# EasyEDA Pro project MN42_v2.eprj, schematic MOAR_Schematic, sheets 1 to 3 of 4

## Sheets
1 PWR/BUTTON/LED: Board Name: MOAR; Create Date: 2025-07-19; Page Name: PWR/BUTTON/LED; Project Name: MN42_v2; Schematic Name: MOAR_Schematic; Update Date: 2025-09-02; Company: EasyEDA.com; Page Size: A4; Version: V1.0
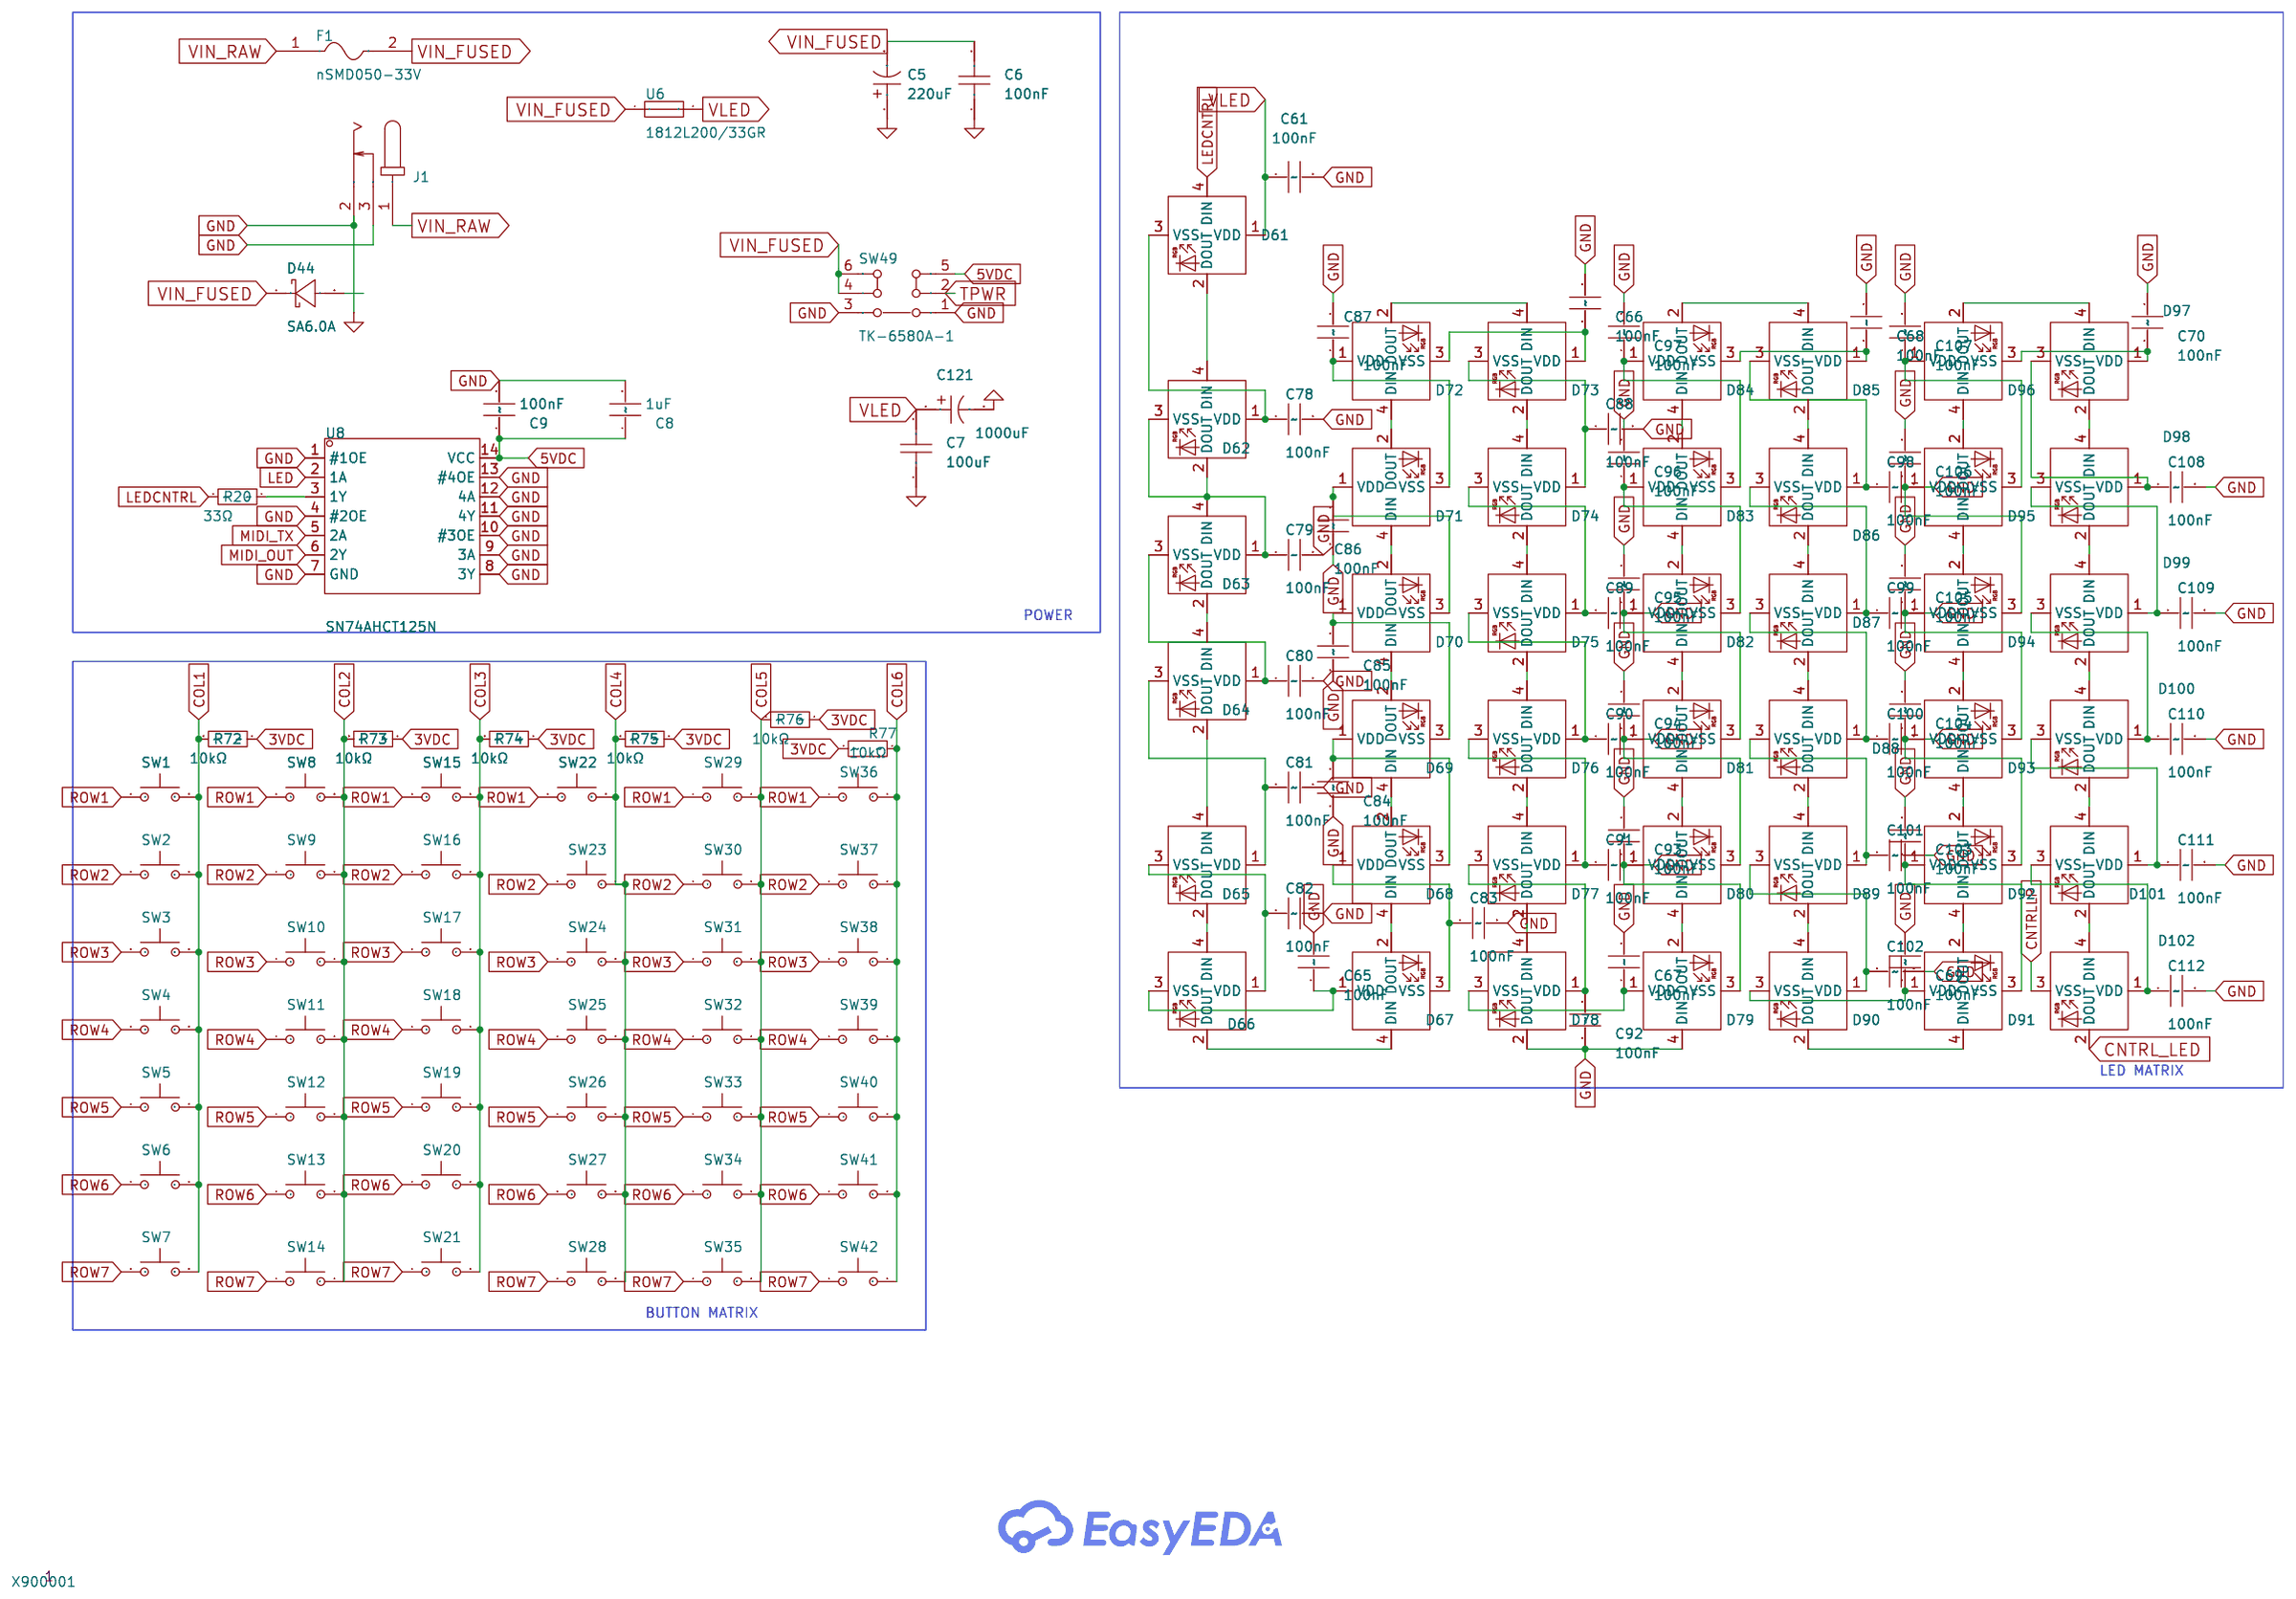
[diagram p0: PWR/BUTTON/LED]
2 INTERFACE/MIDI/CNTRL: Create Date: 2025-08-24; Page Name: INTERFACE/MIDI/CNTRL; Update Date: 2025-08-27
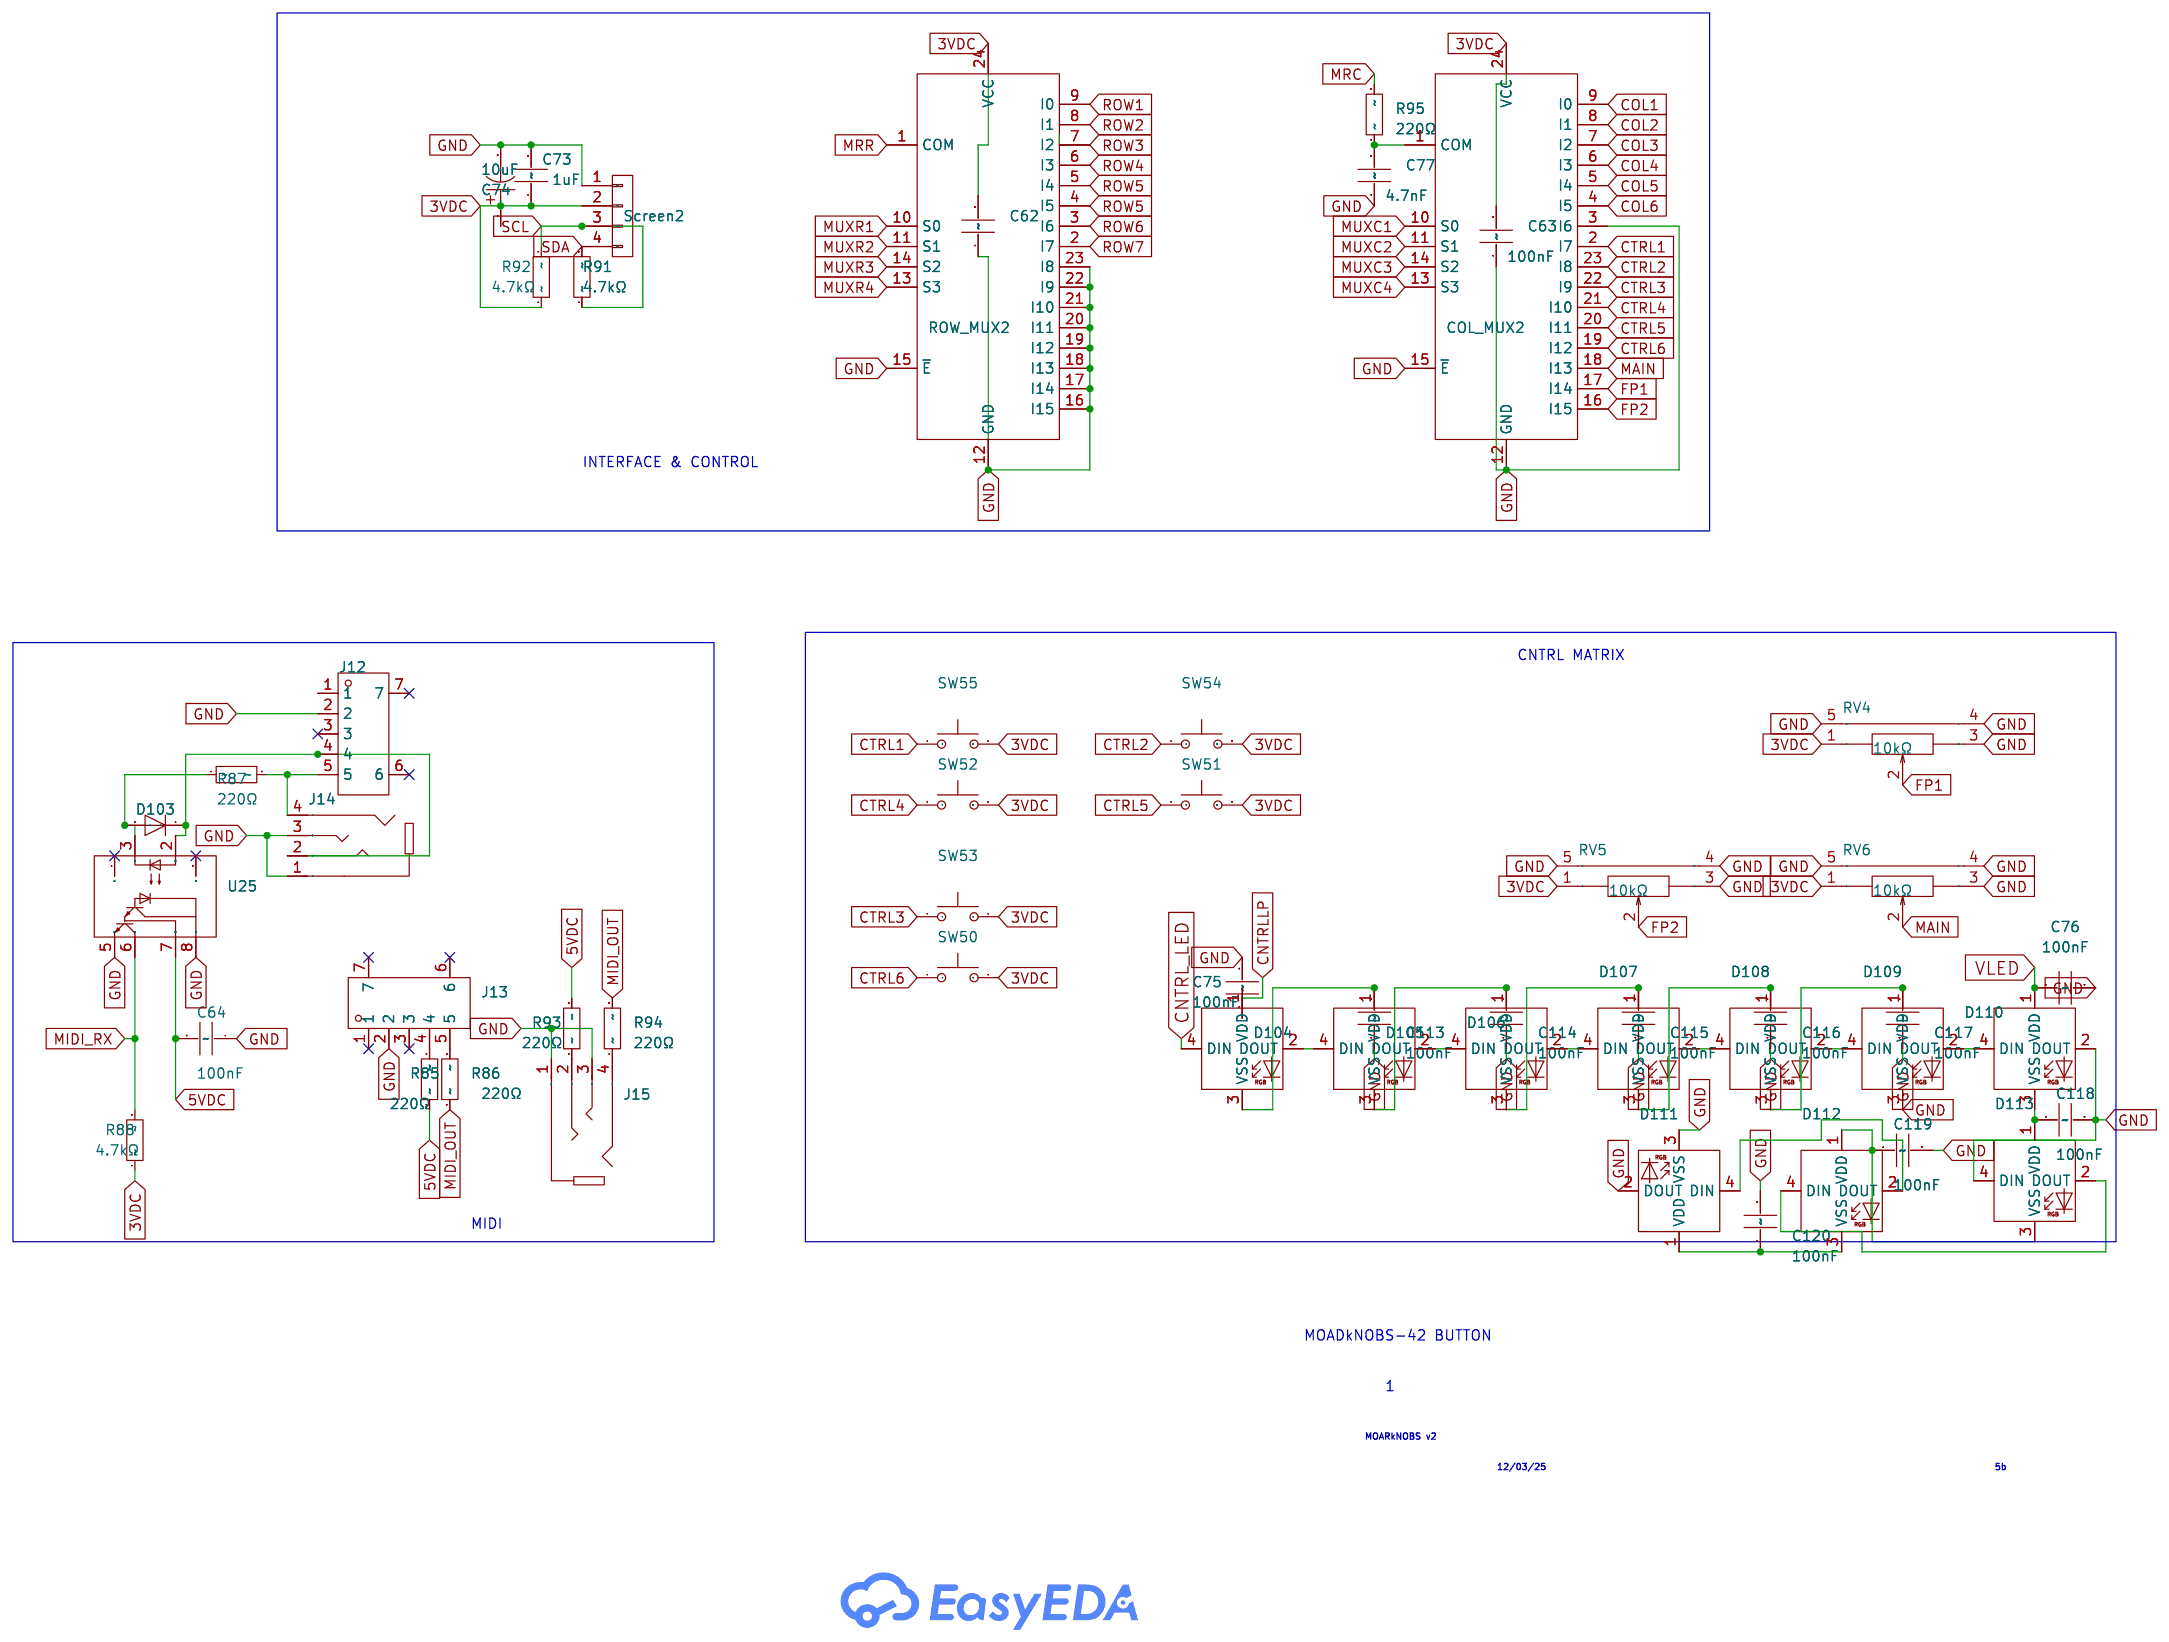
[diagram p1: INTERFACE/MIDI/CNTRL]
3 ENVELOPE: Create Date: 2026-01-12; Page Name: ENVELOPE; Update Date: 2026-01-12
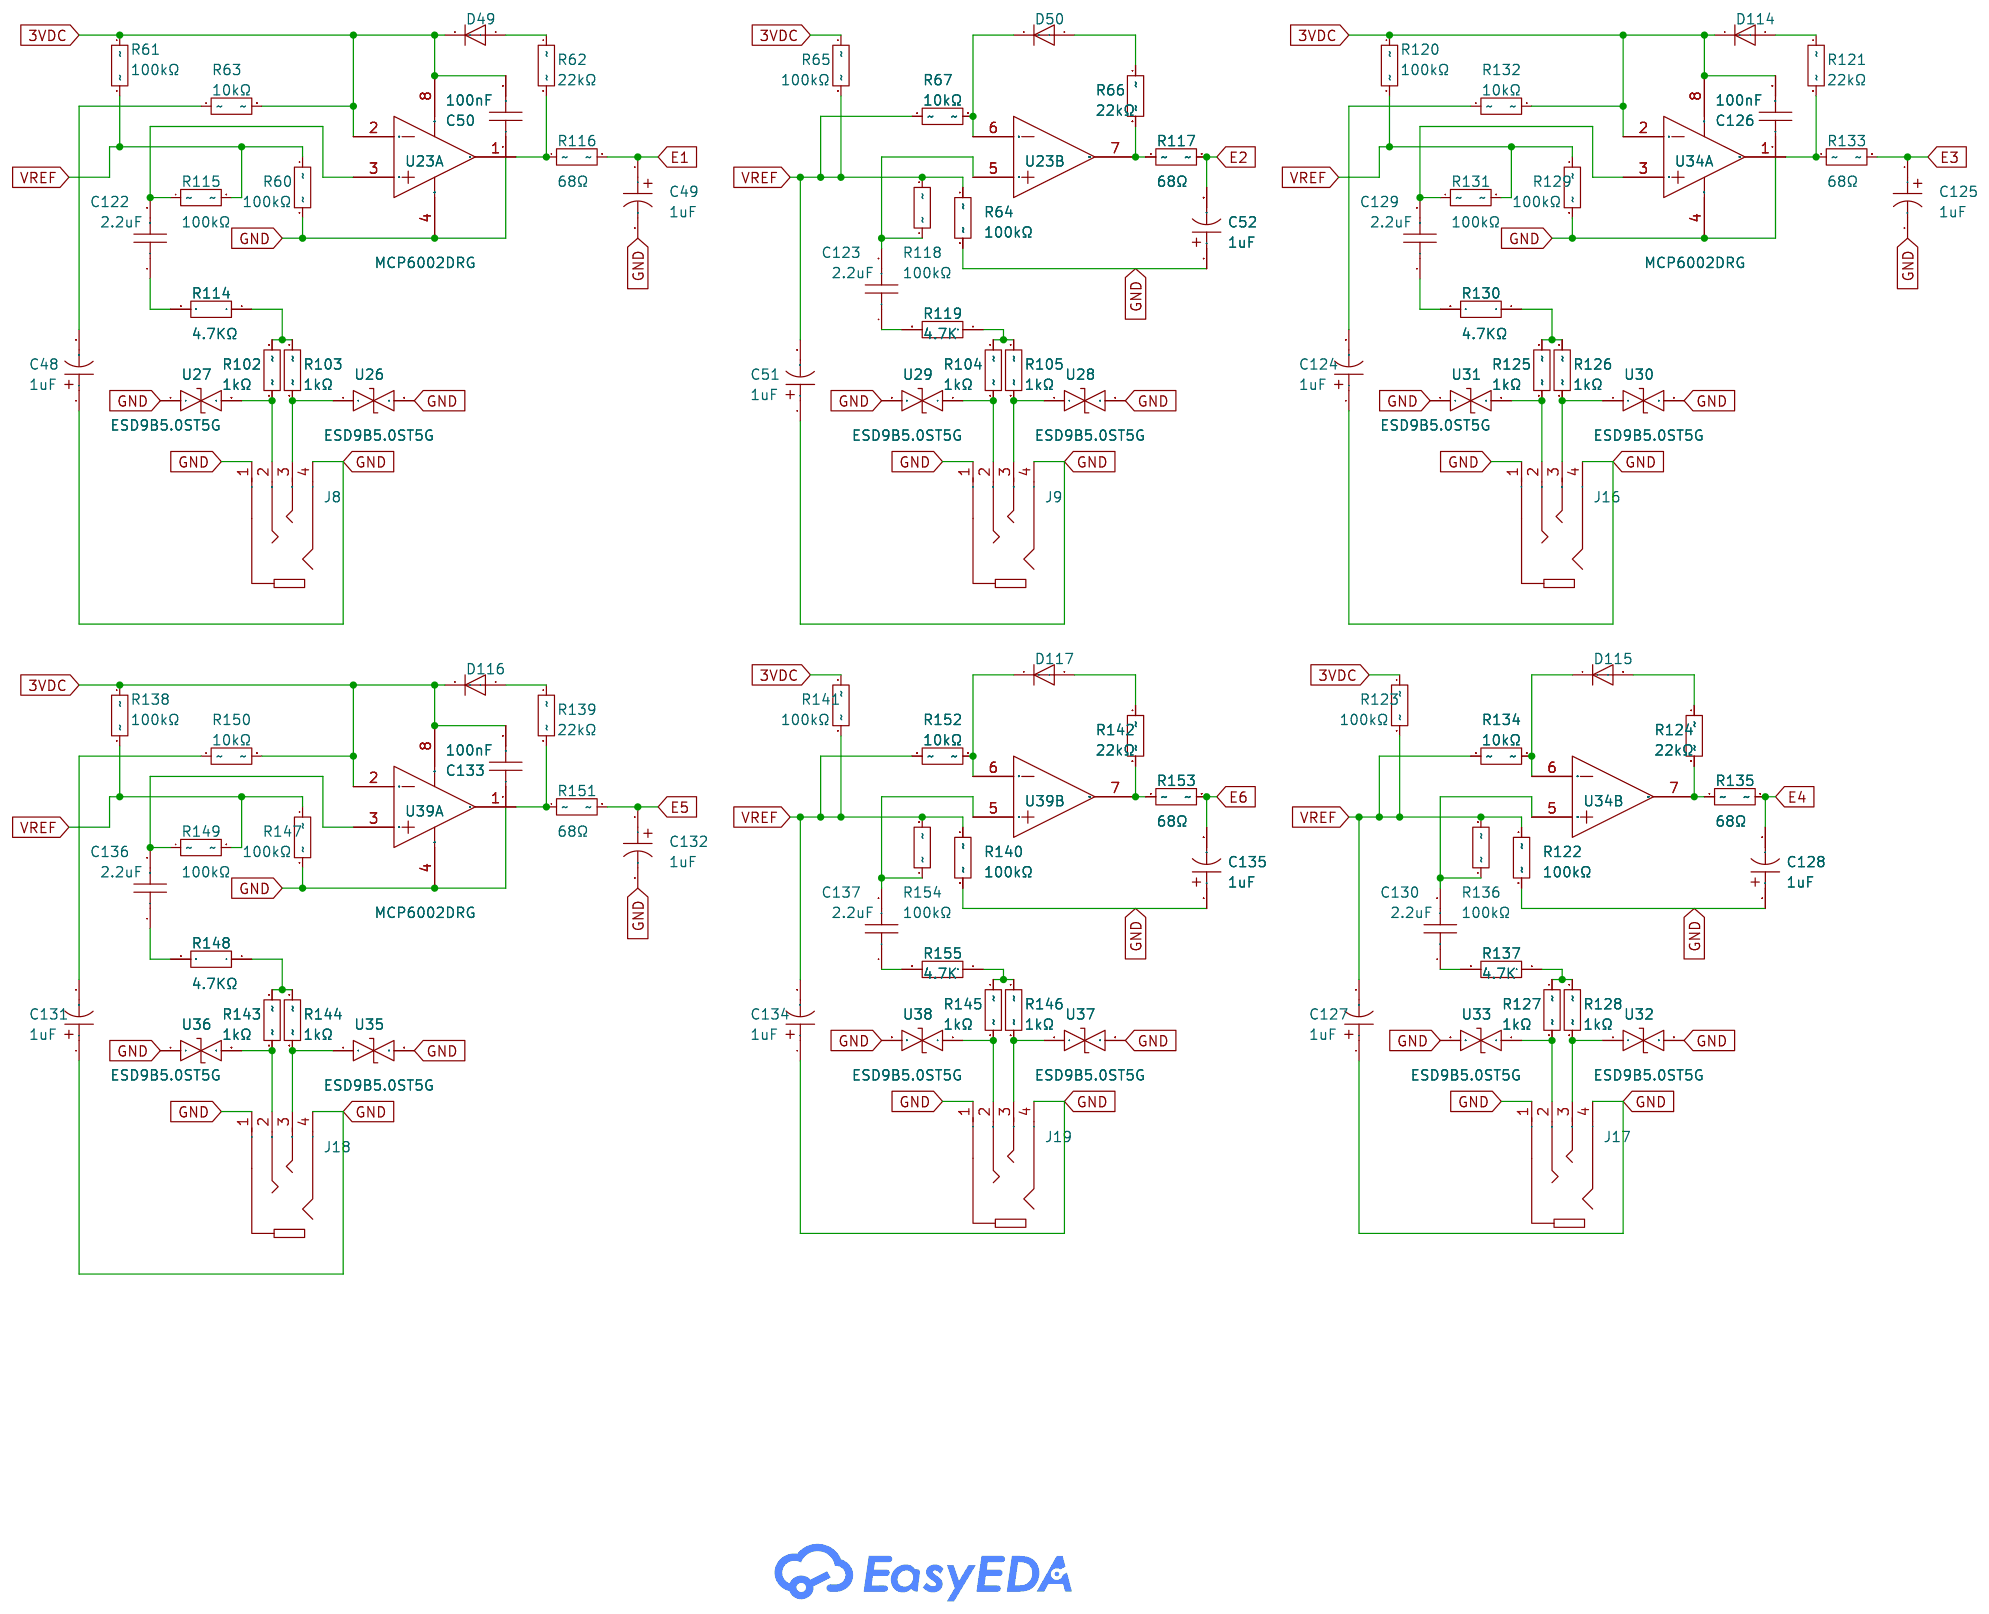
[diagram p2: ENVELOPE]

## Parts
sheet ENVELOPE
C48  1uF  [CAP-SMD_BD6.3-L6.6-W6.6-FD]
C49  1uF  [CAP-SMD_BD6.3-L6.6-W6.6-FD]
C50  100nF  [CAP-TH_L5.0-W2.5-P5.00-D1.0]
C51  1uF  [CAP-SMD_BD6.3-L6.6-W6.6-FD]
C52  1uF  [CAP-SMD_BD6.3-L6.6-W6.6-FD]
C122  2.2uF  [CAP-TH_L5.0-W2.5-P5.00-D1.0]
C123  2.2uF  [CAP-TH_L5.0-W2.5-P5.00-D1.0]
C124  1uF  [CAP-SMD_BD6.3-L6.6-W6.6-FD]
C125  1uF  [CAP-SMD_BD6.3-L6.6-W6.6-FD]
C126  100nF  [CAP-TH_L5.0-W2.5-P5.00-D1.0]
C127  1uF  [CAP-SMD_BD6.3-L6.6-W6.6-FD]
C128  1uF  [CAP-SMD_BD6.3-L6.6-W6.6-FD]
C129  2.2uF  [CAP-TH_L5.0-W2.5-P5.00-D1.0]
C130  2.2uF  [CAP-TH_L5.0-W2.5-P5.00-D1.0]
C131  1uF  [CAP-SMD_BD6.3-L6.6-W6.6-FD]
C132  1uF  [CAP-SMD_BD6.3-L6.6-W6.6-FD]
C133  100nF  [CAP-TH_L5.0-W2.5-P5.00-D1.0]
C134  1uF  [CAP-SMD_BD6.3-L6.6-W6.6-FD]
C135  1uF  [CAP-SMD_BD6.3-L6.6-W6.6-FD]
C136  2.2uF  [CAP-TH_L5.0-W2.5-P5.00-D1.0]
C137  2.2uF  [CAP-TH_L5.0-W2.5-P5.00-D1.0]
D49  1N4148PF  [DO-35_BD1.9-L3.9-P7.90-D0.5-FD]
D50  1N4148PF  [DO-35_BD1.9-L3.9-P7.90-D0.5-FD]
D114  1N4148PF  [DO-35_BD1.9-L3.9-P7.90-D0.5-FD]
D115  1N4148PF  [DO-35_BD1.9-L3.9-P7.90-D0.5-FD]
D116  1N4148PF  [DO-35_BD1.9-L3.9-P7.90-D0.5-FD]
D117  1N4148PF  [DO-35_BD1.9-L3.9-P7.90-D0.5-FD]
J8  HC-PJ-320A  [AUDIO-SMD_HC-PJ-320A]
J9  HC-PJ-320A  [AUDIO-SMD_HC-PJ-320A]
J16  HC-PJ-320A  [AUDIO-SMD_HC-PJ-320A]
J17  HC-PJ-320A  [AUDIO-SMD_HC-PJ-320A]
J18  HC-PJ-320A  [AUDIO-SMD_HC-PJ-320A]
J19  HC-PJ-320A  [AUDIO-SMD_HC-PJ-320A]
R60  100kΩ  [RES-TH_BD1.7-L3.5-P7.50-D0.5]
R61  100kΩ  [RES-TH_BD1.7-L3.5-P7.50-D0.5]
R62  22kΩ  [RES-TH_BD1.7-L3.5-P7.50-D0.5]
R63  10kΩ  [RES-TH_BD1.7-L3.5-P7.50-D0.5]
R64  100kΩ  [RES-TH_BD1.7-L3.5-P7.50-D0.5]
R65  100kΩ  [RES-TH_BD1.7-L3.5-P7.50-D0.5]
R66  22kΩ  [RES-TH_BD1.7-L3.5-P7.50-D0.5]
R67  10kΩ  [RES-TH_BD1.7-L3.5-P7.50-D0.5]
R102  1kΩ  [RES-TH_BD1.7-L3.5-P7.50-D0.5]
R103  1kΩ  [RES-TH_BD1.7-L3.5-P7.50-D0.5]
R104  1kΩ  [RES-TH_BD1.7-L3.5-P7.50-D0.5]
R105  1kΩ  [RES-TH_BD1.7-L3.5-P7.50-D0.5]
R114  4.7KΩ  [R0603]
R115  100kΩ  [RES-TH_BD1.7-L3.5-P7.50-D0.5]
R116  68Ω  [RES-TH_BD1.7-L3.5-P7.50-D0.5]
R117  68Ω  [RES-TH_BD1.7-L3.5-P7.50-D0.5]
R118  100kΩ  [RES-TH_BD1.7-L3.5-P7.50-D0.5]
R119  4.7K  [R0603]
R120  100kΩ  [RES-TH_BD1.7-L3.5-P7.50-D0.5]
R121  22kΩ  [RES-TH_BD1.7-L3.5-P7.50-D0.5]
R122  100kΩ  [RES-TH_BD1.7-L3.5-P7.50-D0.5]
R123  100kΩ  [RES-TH_BD1.7-L3.5-P7.50-D0.5]
R124  22kΩ  [RES-TH_BD1.7-L3.5-P7.50-D0.5]
R125  1kΩ  [RES-TH_BD1.7-L3.5-P7.50-D0.5]
R126  1kΩ  [RES-TH_BD1.7-L3.5-P7.50-D0.5]
R127  1kΩ  [RES-TH_BD1.7-L3.5-P7.50-D0.5]
R128  1kΩ  [RES-TH_BD1.7-L3.5-P7.50-D0.5]
R129  100kΩ  [RES-TH_BD1.7-L3.5-P7.50-D0.5]
R130  4.7KΩ  [R0603]
R131  100kΩ  [RES-TH_BD1.7-L3.5-P7.50-D0.5]
R132  10kΩ  [RES-TH_BD1.7-L3.5-P7.50-D0.5]
R133  68Ω  [RES-TH_BD1.7-L3.5-P7.50-D0.5]
R134  10kΩ  [RES-TH_BD1.7-L3.5-P7.50-D0.5]
R135  68Ω  [RES-TH_BD1.7-L3.5-P7.50-D0.5]
R136  100kΩ  [RES-TH_BD1.7-L3.5-P7.50-D0.5]
R137  4.7K  [R0603]
R138  100kΩ  [RES-TH_BD1.7-L3.5-P7.50-D0.5]
R139  22kΩ  [RES-TH_BD1.7-L3.5-P7.50-D0.5]
R140  100kΩ  [RES-TH_BD1.7-L3.5-P7.50-D0.5]
R141  100kΩ  [RES-TH_BD1.7-L3.5-P7.50-D0.5]
R142  22kΩ  [RES-TH_BD1.7-L3.5-P7.50-D0.5]
R143  1kΩ  [RES-TH_BD1.7-L3.5-P7.50-D0.5]
R144  1kΩ  [RES-TH_BD1.7-L3.5-P7.50-D0.5]
R145  1kΩ  [RES-TH_BD1.7-L3.5-P7.50-D0.5]
R146  1kΩ  [RES-TH_BD1.7-L3.5-P7.50-D0.5]
R147  100kΩ  [RES-TH_BD1.7-L3.5-P7.50-D0.5]
R148  4.7KΩ  [R0603]
R149  100kΩ  [RES-TH_BD1.7-L3.5-P7.50-D0.5]
R150  10kΩ  [RES-TH_BD1.7-L3.5-P7.50-D0.5]
R151  68Ω  [RES-TH_BD1.7-L3.5-P7.50-D0.5]
R152  10kΩ  [RES-TH_BD1.7-L3.5-P7.50-D0.5]
R153  68Ω  [RES-TH_BD1.7-L3.5-P7.50-D0.5]
R154  100kΩ  [RES-TH_BD1.7-L3.5-P7.50-D0.5]
R155  4.7K  [R0603]
U23  MCP6002DRG  [SOP-8_L4.9-W3.9-P1.27-LS6.0-BL]  (sections 1,2)
U26  ESD9B5.0ST5G  [SOD-923_L0.8-W0.6-LS1.0-BI]
U27  ESD9B5.0ST5G  [SOD-923_L0.8-W0.6-LS1.0-BI]
U28  ESD9B5.0ST5G  [SOD-923_L0.8-W0.6-LS1.0-BI]
U29  ESD9B5.0ST5G  [SOD-923_L0.8-W0.6-LS1.0-BI]
U30  ESD9B5.0ST5G  [SOD-923_L0.8-W0.6-LS1.0-BI]
U31  ESD9B5.0ST5G  [SOD-923_L0.8-W0.6-LS1.0-BI]
U32  ESD9B5.0ST5G  [SOD-923_L0.8-W0.6-LS1.0-BI]
U33  ESD9B5.0ST5G  [SOD-923_L0.8-W0.6-LS1.0-BI]
U34  MCP6002DRG  [SOP-8_L4.9-W3.9-P1.27-LS6.0-BL]  (sections 1,2)
U35  ESD9B5.0ST5G  [SOD-923_L0.8-W0.6-LS1.0-BI]
U36  ESD9B5.0ST5G  [SOD-923_L0.8-W0.6-LS1.0-BI]
U37  ESD9B5.0ST5G  [SOD-923_L0.8-W0.6-LS1.0-BI]
U38  ESD9B5.0ST5G  [SOD-923_L0.8-W0.6-LS1.0-BI]
U39  MCP6002DRG  [SOP-8_L4.9-W3.9-P1.27-LS6.0-BL]  (sections 1,2)
sheet INTERFACE/MIDI/CNTRL
C62  100nF  [C0603]
C63  100nF  [C0603]
C64  100nF  [C0603]
C73  1uF  [CAP-TH_L5.0-W4.0-P5.00-D1.0]
C74  10uF  [CAP-SMD_BD6.3-L6.6-W6.6-FD]
C75  100nF  [C0603]
C76  100nF  [C0603]
C77  4.7nF  [CAP-TH_L5.0-W4.0-P5.00-D1.0]
C113  100nF  [C0603]
C114  100nF  [C0603]
C115  100nF  [C0603]
C116  100nF  [C0603]
C117  100nF  [C0603]
C118  100nF  [C0603]
C119  100nF  [C0603]
C120  100nF  [C0603]
COL_MUX2  CD74HC4067M96  [SOIC-24_L15.4-W7.5-P1.27-LS10.3-BL]
D103  1N4148PF  [DO-35_BD1.9-L3.9-P7.90-D0.5-FD]
D104  XL-5050RGBC-WS2812B  [LED-SMD_4P-L5.0-W5.0-BL_XL-5050RGBC]
D105  XL-5050RGBC-WS2812B  [LED-SMD_4P-L5.0-W5.0-BL_XL-5050RGBC]
D106  XL-5050RGBC-WS2812B  [LED-SMD_4P-L5.0-W5.0-BL_XL-5050RGBC]
D107  XL-5050RGBC-WS2812B  [LED-SMD_4P-L5.0-W5.0-BL_XL-5050RGBC]
D108  XL-5050RGBC-WS2812B  [LED-SMD_4P-L5.0-W5.0-BL_XL-5050RGBC]
D109  XL-5050RGBC-WS2812B  [LED-SMD_4P-L5.0-W5.0-BL_XL-5050RGBC]
D110  XL-5050RGBC-WS2812B  [LED-SMD_4P-L5.0-W5.0-BL_XL-5050RGBC]
D111  XL-5050RGBC-WS2812B  [LED-SMD_4P-L5.0-W5.0-BL_XL-5050RGBC]
D112  XL-5050RGBC-WS2812B  [LED-SMD_4P-L5.0-W5.0-BL_XL-5050RGBC]
D113  XL-5050RGBC-WS2812B  [LED-SMD_4P-L5.0-W5.0-BL_XL-5050RGBC]
J12  DIN-504B-M10  [CONN-TH_DIN-504B-M10]
J13  DIN-504B-M10  [CONN-TH_DIN-504B-M10]
J14  HC-PJ-320A  [AUDIO-SMD_HC-PJ-320A]
J15  HC-PJ-320A  [AUDIO-SMD_HC-PJ-320A]
R85  220Ω  [RES-TH_BD1.7-L3.5-P7.50-D0.5]
R86  220Ω  [RES-TH_BD1.7-L3.5-P7.50-D0.5]
R87  220Ω  [RES-TH_BD1.7-L3.5-P7.50-D0.5]
R88  4.7kΩ  [RES-TH_BD1.7-L3.5-P7.50-D0.5]
R91  4.7kΩ  [RES-TH_BD1.7-L3.5-P7.50-D0.5]
R92  4.7kΩ  [RES-TH_BD1.7-L3.5-P7.50-D0.5]
R93  220Ω  [RES-TH_BD1.7-L3.5-P7.50-D0.5]
R94  220Ω  [RES-TH_BD1.7-L3.5-P7.50-D0.5]
R95  220Ω  [RES-TH_BD1.7-L3.5-P7.50-D0.5]
ROW_MUX2  CD74HC4067M96  [SOIC-24_L15.4-W7.5-P1.27-LS10.3-BL]
RV4  10kΩ  [RES-ADJ-TH_RK09K1130A5R]
RV5  10kΩ  [RES-ADJ-TH_RK09K1130A5R]
RV6  10kΩ  [RES-ADJ-TH_RK09K1130A5R]
Screen2  HS96L03W2C03  [OLED-TH_L27.8-W27.2-P2.54_C9900033791]
SW50  HX B3F-4055-Y  [SW-TH_4P-L12.0-W12.0-P5.00-LS12.5]
SW51  HX B3F-4055-Y  [SW-TH_4P-L12.0-W12.0-P5.00-LS12.5]
SW52  HX B3F-4055-Y  [SW-TH_4P-L12.0-W12.0-P5.00-LS12.5]
SW53  HX B3F-4055-Y  [SW-TH_4P-L12.0-W12.0-P5.00-LS12.5]
SW54  HX B3F-4055-Y  [SW-TH_4P-L12.0-W12.0-P5.00-LS12.5]
SW55  HX B3F-4055-Y  [SW-TH_4P-L12.0-W12.0-P5.00-LS12.5]
U25  6N138  [DIP-8_L9.8-W6.6-P2.54-LS7.6-BL]
sheet PWR/BUTTON/LED
C5  220uF  [CAP-SMD_BD6.3-L6.6-W6.6-FD]
C6  100nF  [CAP-TH_L5.0-W2.5-P5.00-D1.0]
C7  100uF  [C1206]
C8  1uF  [CAP-TH_L5.0-W4.0-P5.00-D1.0]
C9  100nF  [C0603]
C61  100nF  [C0603]
C65  100nF  [C0603]
C66  100nF  [C0603]
C67  100nF  [C0603]
C68  100nF  [C0603]
C69  100nF  [C0603]
C70  100nF  [C0603]
C78  100nF  [C0603]
C79  100nF  [C0603]
C80  100nF  [C0603]
C81  100nF  [C0603]
C82  100nF  [C0603]
C83  100nF  [C0603]
C84  100nF  [C0603]
C85  100nF  [C0603]
C86  100nF  [C0603]
C87  100nF  [C0603]
C88  100nF  [C0603]
C89  100nF  [C0603]
C90  100nF  [C0603]
C91  100nF  [C0603]
C92  100nF  [C0603]
C93  100nF  [C0603]
C94  100nF  [C0603]
C95  100nF  [C0603]
C96  100nF  [C0603]
C97  100nF  [C0603]
C98  100nF  [C0603]
C99  100nF  [C0603]
C100  100nF  [C0603]
C101  100nF  [C0603]
C102  100nF  [C0603]
C103  100nF  [C0603]
C104  100nF  [C0603]
C105  100nF  [C0603]
C106  100nF  [C0603]
C107  100nF  [C0603]
C108  100nF  [C0603]
C109  100nF  [C0603]
C110  100nF  [C0603]
C111  100nF  [C0603]
C112  100nF  [C0603]
C121  1000uF  [CAP-TH_BD8.0-P3.50-D0.6-FD]
D44  SA6.0A  [DO-15_BD3.1-L6.7-P10.70-D0.8-RD]
D61  XL-5050RGBC-WS2812B  [LED-SMD_4P-L5.0-W5.0-BL_XL-5050RGBC]
D62  XL-5050RGBC-WS2812B  [LED-SMD_4P-L5.0-W5.0-BL_XL-5050RGBC]
D63  XL-5050RGBC-WS2812B  [LED-SMD_4P-L5.0-W5.0-BL_XL-5050RGBC]
D64  XL-5050RGBC-WS2812B  [LED-SMD_4P-L5.0-W5.0-BL_XL-5050RGBC]
D65  XL-5050RGBC-WS2812B  [LED-SMD_4P-L5.0-W5.0-BL_XL-5050RGBC]
D66  XL-5050RGBC-WS2812B  [LED-SMD_4P-L5.0-W5.0-BL_XL-5050RGBC]
D67  XL-5050RGBC-WS2812B  [LED-SMD_4P-L5.0-W5.0-BL_XL-5050RGBC]
D68  XL-5050RGBC-WS2812B  [LED-SMD_4P-L5.0-W5.0-BL_XL-5050RGBC]
D69  XL-5050RGBC-WS2812B  [LED-SMD_4P-L5.0-W5.0-BL_XL-5050RGBC]
D70  XL-5050RGBC-WS2812B  [LED-SMD_4P-L5.0-W5.0-BL_XL-5050RGBC]
D71  XL-5050RGBC-WS2812B  [LED-SMD_4P-L5.0-W5.0-BL_XL-5050RGBC]
D72  XL-5050RGBC-WS2812B  [LED-SMD_4P-L5.0-W5.0-BL_XL-5050RGBC]
D73  XL-5050RGBC-WS2812B  [LED-SMD_4P-L5.0-W5.0-BL_XL-5050RGBC]
D74  XL-5050RGBC-WS2812B  [LED-SMD_4P-L5.0-W5.0-BL_XL-5050RGBC]
D75  XL-5050RGBC-WS2812B  [LED-SMD_4P-L5.0-W5.0-BL_XL-5050RGBC]
D76  XL-5050RGBC-WS2812B  [LED-SMD_4P-L5.0-W5.0-BL_XL-5050RGBC]
D77  XL-5050RGBC-WS2812B  [LED-SMD_4P-L5.0-W5.0-BL_XL-5050RGBC]
D78  XL-5050RGBC-WS2812B  [LED-SMD_4P-L5.0-W5.0-BL_XL-5050RGBC]
D79  XL-5050RGBC-WS2812B  [LED-SMD_4P-L5.0-W5.0-BL_XL-5050RGBC]
D80  XL-5050RGBC-WS2812B  [LED-SMD_4P-L5.0-W5.0-BL_XL-5050RGBC]
D81  XL-5050RGBC-WS2812B  [LED-SMD_4P-L5.0-W5.0-BL_XL-5050RGBC]
D82  XL-5050RGBC-WS2812B  [LED-SMD_4P-L5.0-W5.0-BL_XL-5050RGBC]
D83  XL-5050RGBC-WS2812B  [LED-SMD_4P-L5.0-W5.0-BL_XL-5050RGBC]
D84  XL-5050RGBC-WS2812B  [LED-SMD_4P-L5.0-W5.0-BL_XL-5050RGBC]
D85  XL-5050RGBC-WS2812B  [LED-SMD_4P-L5.0-W5.0-BL_XL-5050RGBC]
D86  XL-5050RGBC-WS2812B  [LED-SMD_4P-L5.0-W5.0-BL_XL-5050RGBC]
D87  XL-5050RGBC-WS2812B  [LED-SMD_4P-L5.0-W5.0-BL_XL-5050RGBC]
D88  XL-5050RGBC-WS2812B  [LED-SMD_4P-L5.0-W5.0-BL_XL-5050RGBC]
D89  XL-5050RGBC-WS2812B  [LED-SMD_4P-L5.0-W5.0-BL_XL-5050RGBC]
D90  XL-5050RGBC-WS2812B  [LED-SMD_4P-L5.0-W5.0-BL_XL-5050RGBC]
D91  XL-5050RGBC-WS2812B  [LED-SMD_4P-L5.0-W5.0-BL_XL-5050RGBC]
D92  XL-5050RGBC-WS2812B  [LED-SMD_4P-L5.0-W5.0-BL_XL-5050RGBC]
D93  XL-5050RGBC-WS2812B  [LED-SMD_4P-L5.0-W5.0-BL_XL-5050RGBC]
D94  XL-5050RGBC-WS2812B  [LED-SMD_4P-L5.0-W5.0-BL_XL-5050RGBC]
D95  XL-5050RGBC-WS2812B  [LED-SMD_4P-L5.0-W5.0-BL_XL-5050RGBC]
D96  XL-5050RGBC-WS2812B  [LED-SMD_4P-L5.0-W5.0-BL_XL-5050RGBC]
D97  XL-5050RGBC-WS2812B  [LED-SMD_4P-L5.0-W5.0-BL_XL-5050RGBC]
D98  XL-5050RGBC-WS2812B  [LED-SMD_4P-L5.0-W5.0-BL_XL-5050RGBC]
D99  XL-5050RGBC-WS2812B  [LED-SMD_4P-L5.0-W5.0-BL_XL-5050RGBC]
D100  XL-5050RGBC-WS2812B  [LED-SMD_4P-L5.0-W5.0-BL_XL-5050RGBC]
D101  XL-5050RGBC-WS2812B  [LED-SMD_4P-L5.0-W5.0-BL_XL-5050RGBC]
D102  XL-5050RGBC-WS2812B  [LED-SMD_4P-L5.0-W5.0-BL_XL-5050RGBC]
F1  nSMD050-33V  [F1206]
J1  DC005  [DC-IN-TH_DC005]
R20  33Ω  [RES-TH_BD1.7-L3.5-P7.50-D0.5]
R72  10kΩ  [RES-TH_BD1.7-L3.5-P7.50-D0.5]
R73  10kΩ  [RES-TH_BD1.7-L3.5-P7.50-D0.5]
R74  10kΩ  [RES-TH_BD1.7-L3.5-P7.50-D0.5]
R75  10kΩ  [RES-TH_BD1.7-L3.5-P7.50-D0.5]
R76  10kΩ  [RES-TH_BD1.7-L3.5-P7.50-D0.5]
R77  10kΩ  [RES-TH_BD1.7-L3.5-P7.50-D0.5]
SW1  HX B3F-4055-Y  [SW-TH_4P-L12.0-W12.0-P5.00-LS12.5]
SW2  HX B3F-4055-Y  [SW-TH_4P-L12.0-W12.0-P5.00-LS12.5]
SW3  HX B3F-4055-Y  [SW-TH_4P-L12.0-W12.0-P5.00-LS12.5]
SW4  HX B3F-4055-Y  [SW-TH_4P-L12.0-W12.0-P5.00-LS12.5]
SW5  HX B3F-4055-Y  [SW-TH_4P-L12.0-W12.0-P5.00-LS12.5]
SW6  HX B3F-4055-Y  [SW-TH_4P-L12.0-W12.0-P5.00-LS12.5]
SW7  HX B3F-4055-Y  [SW-TH_4P-L12.0-W12.0-P5.00-LS12.5]
SW8  HX B3F-4055-Y  [SW-TH_4P-L12.0-W12.0-P5.00-LS12.5]
SW9  HX B3F-4055-Y  [SW-TH_4P-L12.0-W12.0-P5.00-LS12.5]
SW10  HX B3F-4055-Y  [SW-TH_4P-L12.0-W12.0-P5.00-LS12.5]
SW11  HX B3F-4055-Y  [SW-TH_4P-L12.0-W12.0-P5.00-LS12.5]
SW12  HX B3F-4055-Y  [SW-TH_4P-L12.0-W12.0-P5.00-LS12.5]
SW13  HX B3F-4055-Y  [SW-TH_4P-L12.0-W12.0-P5.00-LS12.5]
SW14  HX B3F-4055-Y  [SW-TH_4P-L12.0-W12.0-P5.00-LS12.5]
SW15  HX B3F-4055-Y  [SW-TH_4P-L12.0-W12.0-P5.00-LS12.5]
SW16  HX B3F-4055-Y  [SW-TH_4P-L12.0-W12.0-P5.00-LS12.5]
SW17  HX B3F-4055-Y  [SW-TH_4P-L12.0-W12.0-P5.00-LS12.5]
SW18  HX B3F-4055-Y  [SW-TH_4P-L12.0-W12.0-P5.00-LS12.5]
SW19  HX B3F-4055-Y  [SW-TH_4P-L12.0-W12.0-P5.00-LS12.5]
SW20  HX B3F-4055-Y  [SW-TH_4P-L12.0-W12.0-P5.00-LS12.5]
SW21  HX B3F-4055-Y  [SW-TH_4P-L12.0-W12.0-P5.00-LS12.5]
SW22  HX B3F-4055-Y  [SW-TH_4P-L12.0-W12.0-P5.00-LS12.5]
SW23  HX B3F-4055-Y  [SW-TH_4P-L12.0-W12.0-P5.00-LS12.5]
SW24  HX B3F-4055-Y  [SW-TH_4P-L12.0-W12.0-P5.00-LS12.5]
SW25  HX B3F-4055-Y  [SW-TH_4P-L12.0-W12.0-P5.00-LS12.5]
SW26  HX B3F-4055-Y  [SW-TH_4P-L12.0-W12.0-P5.00-LS12.5]
SW27  HX B3F-4055-Y  [SW-TH_4P-L12.0-W12.0-P5.00-LS12.5]
SW28  HX B3F-4055-Y  [SW-TH_4P-L12.0-W12.0-P5.00-LS12.5]
SW29  HX B3F-4055-Y  [SW-TH_4P-L12.0-W12.0-P5.00-LS12.5]
SW30  HX B3F-4055-Y  [SW-TH_4P-L12.0-W12.0-P5.00-LS12.5]
SW31  HX B3F-4055-Y  [SW-TH_4P-L12.0-W12.0-P5.00-LS12.5]
SW32  HX B3F-4055-Y  [SW-TH_4P-L12.0-W12.0-P5.00-LS12.5]
SW33  HX B3F-4055-Y  [SW-TH_4P-L12.0-W12.0-P5.00-LS12.5]
SW34  HX B3F-4055-Y  [SW-TH_4P-L12.0-W12.0-P5.00-LS12.5]
SW35  HX B3F-4055-Y  [SW-TH_4P-L12.0-W12.0-P5.00-LS12.5]
SW36  HX B3F-4055-Y  [SW-TH_4P-L12.0-W12.0-P5.00-LS12.5]
SW37  HX B3F-4055-Y  [SW-TH_4P-L12.0-W12.0-P5.00-LS12.5]
SW38  HX B3F-4055-Y  [SW-TH_4P-L12.0-W12.0-P5.00-LS12.5]
SW39  HX B3F-4055-Y  [SW-TH_4P-L12.0-W12.0-P5.00-LS12.5]
SW40  HX B3F-4055-Y  [SW-TH_4P-L12.0-W12.0-P5.00-LS12.5]
SW41  HX B3F-4055-Y  [SW-TH_4P-L12.0-W12.0-P5.00-LS12.5]
SW42  HX B3F-4055-Y  [SW-TH_4P-L12.0-W12.0-P5.00-LS12.5]
SW49  TK-6580A-1  [SW-TH_TK-6580A-1]
U6  1812L200/33GR  [F1812]
U8  SN74AHCT125N  [PDIP-14_L19.3-W6.4-P2.54-LS7.6-BL]

## Library data of the parts
C5 C48 C49 C51 C52 C74 C124 C125 C127 C128 C131 C132 C134 C135 = 189RV0019: Capacitance:220uF Tolerance:±20% Tolerance:±20% Voltage Rating:35V Ripple Current:600mA@100KHz Equivalent Series Resistance(ESR):160mΩ@100KHz Diameter:6.3mm Height - Seated (Max):7.7mm Lifetime:2000hrs@105℃ Operating Temperature:-55℃~+105℃ Operating Tempe; LCSC Part Name: 220uF ±20% 35V; Supplier Part: C7471881; Manufacturer: KNSCHA(科尼盛); Supplier Footprint: SMD,D6.3xL7.7mm; JLCPCB Part Class: Extended Part; Datasheet: https://atta.szlcsc.com/upload/public/pdf/source/20230907/E1EFA38CB5E88857ECE494F7E9D8FBCC.pdf; Supplier: LCSC; Tolerance: ±20%; Voltage Rating: 35V; Ripple Current: 600mA@100KHz; Equivalent Series Resistance(ESR): 160mΩ@100KHz; Diameter: 6.3mm; Height - Seated (Max): 7.7mm; Lifetime: 2000hrs@105℃; Operating Temperature: -55℃~+105℃
C6 C50 C122 C123 C126 C129 C130 C133 C136 C137 = CC1H104MC1FD3F6C10MF: Capacitance:100nF Tolerance:±20% Tolerance:±20% Voltage Rating:50V Pin Spacing:5.08mm Temperature Coefficient:Y5V Diameter:6mm Body Thickness:2.2mm; LCSC Part Name: 100nF ±20% 50V; Supplier Part: C254085; Manufacturer: Dersonic(德尔创); Supplier Footprint: 插件,P=5.08mm; JLCPCB Part Class: Extended Part; Datasheet: https://atta.szlcsc.com/upload/public/pdf/source/20200826/C254085_159DD65BF32BF11C9168D341BCE23E6F.pdf; Supplier: LCSC; Tolerance: ±20%; Voltage Rating: 50V; Pin Spacing: 5.08mm; Temperature Coefficient: Y5V; Diameter: 6mm; Body Thickness: 2.2mm
D49 D50 D103 D114-D117 = 1N4148PF: Supplier Part: C2992430; Manufacturer: ST(先科); Supplier Footprint: DO-35; JLCPCB Part Class: Extended Part; Datasheet: https://atta.szlcsc.com/upload/public/pdf/source/20220414/133B43E450E13E2641A7D12D66654211.pdf; Supplier: LCSC
J8 J9 J14-J19 = HC-PJ-320A: Connector Type:3.5mm Headphone Jack Current Rating:500mA Voltage Rating (Max):30V Contact Material:Copper Contact Plating:Nickel Operating Temperature:-25℃~+70℃ Operating Temperature:-25℃~+70℃; LCSC Part Name: 黑色 3.5mm耳机座 PJ-320A 插件黑色; Supplier Part: C7501806; Manufacturer: HC(虹成电子); Supplier Footprint: 插件; JLCPCB Part Class: Extended Part; Datasheet: https://atta.szlcsc.com/upload/public/pdf/source/20250106/7D33987A36C8C755DD3F52F3C7FA5722.pdf; Supplier: LCSC; Connector Type: 3.5mm Headphone Jack; Current Rating: 500mA; Voltage Rating (Max): 30V; Contact Material: Copper; Contact Plating: Nickel; Operating Temperature: -25℃~+70℃
R60-R67 R88 R91 R92 R102-R105 R115-R118 R120-R129 R131-R136 R138-R147 R149-R154 = RN 1/8W 4K7 F T/B A1: Type:Metal Film Resistors Resistance: Tolerance:±1% Tolerance:±1% Overload Voltage (Max):150V Power(Watts):125mW Temperature Coefficient:±50ppm/℃ Temperature Coefficient:±50ppm/℃ Operating Temperature Range:-55℃~+125℃ Operating Temperature Range:-55℃~+125; LCSC Part Name: 4.7kΩ ±1% 125mW 金属膜电阻; Supplier Part: C433477; Manufacturer: Tyohm(幸亚电阻); Supplier Footprint: 插件,D1.7xL3.5mm; JLCPCB Part Class: Extended Part; Datasheet: https://atta.szlcsc.com/upload/public/pdf/source/20191008/C433681_B72693A7FD256E0D1DC5EFE3F095EED3.pdf; Supplier: LCSC; Type: Metal Film Resistors; Tolerance: ±1%; Overload Voltage (Max): 150V; Power(Watts): 125mW; Temperature Coefficient: ±50ppm/℃; Operating Temperature Range: -55℃~+125℃
R114 R119 R130 R137 R148 R155 = Res_0603: Supplier Footprint: 0603
U23 U34 U39 = MCP6002DRG: LCSC Part Name: 带射频滤波器的1Mhz cmos轨到轨IO光放大器; Supplier Part: C5145244; Manufacturer: HGC(深圳汉芯); Supplier Footprint: SOP-8; JLCPCB Part Class: Extended Part; Datasheet: https://atta.szlcsc.com/upload/public/pdf/source/20240611/76E5A89C667E57E3492874B73CA75C44.pdf; Supplier: LCSC; Number of Circuits: Dual; Maximum Power Supply Range (Vdd-Vss): 6V; Rail to Rail: Rail-to-rail input, rail-to-rail output; Gain Bandwidth Product(GBP): 1MHz; Voltage - Input Offset(Vos): 3.5mV; Input Offset Voltage Drift (Vos TC): 2.7uV/℃; Slew Rate(SR): 0.8V/us; Noise density(eN): 20nV/√Hz@10kHz; Common Mode Rejection Ratio (CMRR): 68dB; Operating Temperature: -40℃~+125℃
U26-U33 U35-U38 = ESD9B5.0ST5G_C3021104: Supplier Part: C3021104; Manufacturer: TECH PUBLIC(台舟); Supplier Footprint: SOD-923(0402); JLCPCB Part Class: Extended Part; Datasheet: https://item.szlcsc.com/datasheet/ESD9B5.0ST5G/3544086.html; Supplier: LCSC; Polarity: Bidirectional; Reverse Stand-Off Voltage (Vrwm): 5V; Clamping Voltage: 10V; Peak Pulse Current (Ipp): 8A@8/20us; Peak Pulse Power Dissipation (Ppp): 80W@8/20us; Voltage - Breakdown: 8.4V; Reverse Leakage Current (Ir): 80nA; Number of Channels: 1; Operating Temperature: -55℃~+125℃; level of protection: IEC 61000-4-2；IEC 61000-4-5; Type: ESD; Junction Capacitance: 15pF
C9 C61-C70 C75 C76 C78-C120 = TCC0603X7R104K500CT: Capacitance:100nF Tolerance:±10% Tolerance:±10% Voltage Rating:50V Temperature Coefficient:X7R; LCSC Part Name: 100nF ±10% 50V; Supplier Part: C282519; Manufacturer: CCTC(三环); Supplier Footprint: 0603; JLCPCB Part Class: Extended Part; Datasheet: https://item.szlcsc.com/datasheet/TCC0603X7R104K500CT/268639.html; Supplier: LCSC; Tolerance: ±10%; Voltage Rating: 50V; Temperature Coefficient: X7R
C8 C73 C77 = CT4G-0805-2X1-63V-0.1μF-K: Capacitance:100nF Tolerance:±10% Tolerance:±10% Voltage Rating:63V Temperature Coefficient:-; LCSC Part Name: 100nF ±10% 63V; Supplier Part: C400087; Manufacturer: TORCH(火炬); Supplier Footprint: 插件,P=5.08mm; JLCPCB Part Class: Extended Part; Datasheet: https://atta.szlcsc.com/upload/public/pdf/source/20191118/C454433_59D9A4E5EF49F2CA9CCAEF3FF757A9ED.pdf; Supplier: LCSC; Tolerance: ±10%; Voltage Rating: 63V
COL_MUX2 ROW_MUX2 = CD74HC4067M96: Switch Circuit:- Number of Channels:16 Supply Voltage:2V~6V Supply Voltage:2V~6V Turn-on time:83ns On-State Resistance (Max):200Ω Turn-off time:83ns Operating Temperature:-55℃~+125℃ Operating Temperature:-55℃~+125℃; LCSC Part Name: 高速CMOS逻辑16通道模拟多路复用器/解复用器; Supplier Part: C496123; Manufacturer: TI(德州仪器); Supplier Footprint: SOIC-24-300mil; JLCPCB Part Class: Extended Part; Datasheet: https://www.ti.com/cn/lit/gpn/cd74hc4067; Supplier: LCSC; Number of Channels: 16; Supply Voltage: 2V~6V; Turn-on time: 83ns; On-State Resistance (Max): 200Ω; Turn-off time: 83ns; Operating Temperature: -55℃~+125℃
D61-D102 D104-D113 = XL-5050RGBC-WS2812B: Supplier Part: C2843785; Manufacturer: XINGLIGHT(成兴光); Supplier Footprint: SMD5050; JLCPCB Part Class: Extended Part; Datasheet: https://atta.szlcsc.com/upload/public/pdf/source/20240412/E1004CAA80592E31D08BFE019083806F.pdf; Supplier: LCSC
J12 J13 = DIN-504B-M10: Supplier Part: C2939346; Manufacturer: HOOYA(皓宇电子); Supplier Footprint: 插件; JLCPCB Part Class: Extended Part; Datasheet: https://atta.szlcsc.com/upload/public/pdf/source/20220120/ABB2570656C6359DBC61E5C1017AC323.pdf; Supplier: LCSC
R85-R87 R93-R95 = RN 1/8W 220R F T/B A1: Type:Metal Film Resistors Resistance: Tolerance:±1% Tolerance:±1% Overload Voltage (Max):150V Power(Watts):125mW Temperature Coefficient:±50ppm/℃ Temperature Coefficient:±50ppm/℃ Operating Temperature Range:-55℃~+125℃ Operating Temperature Range:-55℃~+125; LCSC Part Name: 220Ω ±1% 125mW 金属膜电阻; Supplier Part: C433487; Manufacturer: Tyohm(幸亚电阻); Supplier Footprint: 插件,D1.7xL3.5mm; JLCPCB Part Class: Extended Part; Datasheet: https://atta.szlcsc.com/upload/public/pdf/source/20191008/C433681_B72693A7FD256E0D1DC5EFE3F095EED3.pdf; Supplier: LCSC; Type: Metal Film Resistors; Tolerance: ±1%; Overload Voltage (Max): 150V; Power(Watts): 125mW; Temperature Coefficient: ±50ppm/℃; Operating Temperature Range: -55℃~+125℃
RV4-RV6 = RK09K1130A5R: Resistance: Tolerance:±20% Tolerance:±20%; LCSC Part Name: 10kΩ ±20%; Supplier Part: C209779; Manufacturer: ALPSALPINE(阿尔卑斯阿尔派); Supplier Footprint: 插件; JLCPCB Part Class: Extended Part; Datasheet: https://atta.szlcsc.com/upload/public/pdf/source/20180404/C209779_144B5EF41D1B8507FF4660D0445AF581.pdf; Supplier: LCSC; Tolerance: ±20%
Screen2 = HS96L03W2C03: Main Control Chip:SSD1315 Interface Type:I2C Size:0.96 Pixel Resolution:128x64 Operating Temperature:-40℃~+70℃ Operating Temperature:-40℃~+70℃; LCSC Part Name: 0.96寸OLED显示屏窄白光IIC; Supplier Part: C5248080; Manufacturer: HS(汉昇); JLCPCB Part Class: Extended Part; Datasheet: https://atta.szlcsc.com/upload/public/pdf/source/20230627/763D01F79A90007632F098068C7C8AD9.pdf; Supplier: LCSC; Main Control Chip: SSD1315; Interface Type: I2C; Size: 0.96; Pixel Resolution: 128x64; Operating Temperature: -40℃~+70℃
SW1-SW42 SW50-SW55 = HX B3F-4055-Y: Actuator Style:Square Plunger Operating Force:2.5N Mounting Type:Direct Insert Length:11.8mm Width:11.8mm Switch Height:7.3mm Strike Gundam:- Contact Current:50mA Voltage Rating:12V Actuator/Cap Color:Yellow With Lamp:None IP Rating:- Termination Style:PC; LCSC Part Name: 12*12*7.3mm 直插 轻触开关; Supplier Part: C36498965; Manufacturer: hanxia(韩下); Supplier Footprint: DIP,12x12mm; JLCPCB Part Class: Extended Part; Datasheet: https://atta.szlcsc.com/upload/public/pdf/source/20241121/FA8A3B5FC41001412F2E47168C08B6C2.pdf; Supplier: LCSC; Actuator Style: Square Plunger; Operating Force: 2.5N; Mounting Type: Direct Insert; Length: 11.8mm; Width: 11.8mm; Switch Height: 7.3mm; Contact Current: 50mA; Voltage Rating: 12V; Actuator/Cap Color: Yellow; With Lamp: None; Termination Style: PCPin; Life: 100,000 Times; Operating Temperature: -25℃~+85℃
U25 = 6N138: Input Type:DC Supply Voltage:- Supply Voltage:- Isolation Voltage(rms):5kV Common Mode Transient Immunity (CMTI):1kV/us Number of Channels:1 Operating Temperature:-55℃~+85℃ Operating Temperature:-55℃~+85℃; LCSC Part Name: DC输入 1通道 隔离电压(rms):5000V; Supplier Part: C255743; Manufacturer: ISOCOM(英国安数光); Supplier Footprint: DIP-8; JLCPCB Part Class: Extended Part; Datasheet: https://atta.szlcsc.com/upload/public/pdf/source/20180822/C255747_0DE46B44EFBF5BF2F7E9C825E24779A2.pdf; Supplier: LCSC; Input Type: DC; Isolation Voltage(rms): 5kV; Common Mode Transient Immunity (CMTI): 1kV/us; Number of Channels: 1; Operating Temperature: -55℃~+85℃
C7 = HGC1206R5107M100NSPJ: Capacitance:100uF Tolerance:±20% Tolerance:±20% Voltage Rating:10V Temperature Coefficient:X5R; LCSC Part Name: 100uF ±20% 10V; Supplier Part: C7432784; Manufacturer: Chinocera(华瓷); Supplier Footprint: 1206; JLCPCB Part Class: Extended Part; Datasheet: https://atta.szlcsc.com/upload/public/pdf/source/20240320/FAC3FEC40A78BC5CCCE96C232A94D860.pdf; Supplier: LCSC; Tolerance: ±20%; Voltage Rating: 10V; Temperature Coefficient: X5R
C121 = NPXD0901B102MJTM: LCSC Part Name: 1000uF ±20% 12V; Supplier Part: C2976189; Manufacturer: Ymin(永铭); Supplier Footprint: 插件,D8xL9mm; JLCPCB Part Class: Extended Part; Supplier: LCSC; Tolerance: ±20%; Voltage Rating: 12V; Diameter: 8mm; Height - Seated (Max): 9mm; Operating Temperature: -55℃~+105℃
D44 = SA6.0A: Reverse Stand-Off Voltage (Vrwm):6V Maximum Clamping Voltage:10.3V Peak Pulse Current (Ipp)@10/1000us:49.5A Peak Pulse Power Dissipation (Ppp)@10/1000us:500W Breakdown Voltage:6.67V Type:TVS; LCSC Part Name: TVS 6V截止 49.5A峰值脉冲; Supplier Part: C1973281; Manufacturer: Littelfuse(美国力特); Supplier Footprint: DO-15(DO-204AC); JLCPCB Part Class: Extended Part; Datasheet: https://atta.szlcsc.com/upload/public/pdf/source/20210601/0B3E4F854A384945BCD9F467CEEB89B0.pdf; Supplier: LCSC; Reverse Stand-Off Voltage (Vrwm): 6V; Maximum Clamping Voltage: 10.3V; Peak Pulse Current (Ipp)@10/1000us: 49.5A; Peak Pulse Power Dissipation (Ppp)@10/1000us: 500W; Breakdown Voltage: 6.67V; Type: TVS
F1 = nSMD050-33V: Voltage - Max:33V Current - Max:100A Hold Current:500mA Trip Current:1A; LCSC Part Name: 0.50A  33V 自恢复保险丝; Supplier Part: C70077; Manufacturer: 台湾陆海; Supplier Footprint: 1206; JLCPCB Part Class: Extended Part; Datasheet: https://atta.szlcsc.com/upload/public/pdf/source/20180608/C70077_B8D50CC58F6AC16481F48F7D0521DF66.pdf; Supplier: LCSC; Voltage - Max: 33V; Current - Max: 100A; Hold Current: 500mA; Trip Current: 1A
J1 = DC005: Connector Type:DC Power Receptacle Mounting Style:Bend-in Inside Contact Diameter:2mm Outside Contact Diameter:6.3mm Current Rating (Max):500mA Voltage Rating (Max):30V Operating Temperature Range:-25℃~+70℃ Operating Temperature Range:-25℃~+70℃; LCSC Part Name: DC电源插座 内径:2mm 外径:6.3mm; Supplier Part: C431533; Manufacturer: SHOU HAN(首韩); Supplier Footprint: 插件; JLCPCB Part Class: Extended Part; Datasheet: https://atta.szlcsc.com/upload/public/pdf/source/20190925/C431533_4751811035784AC1D38EBC85F7905E99.pdf; Supplier: LCSC; Connector Type: DC Power Receptacle; Mounting Style: Bend-in; Inside Contact Diameter: 2mm; Outside Contact Diameter: 6.3mm; Current Rating (Max): 500mA; Voltage Rating (Max): 30V; Operating Temperature Range: -25℃~+70℃
R20 R72-R77 = RN1/8W10KFT/BA1: Type:Metal Film Resistors Resistance: Tolerance:±1% Tolerance:±1% Overload Voltage (Max):150V Power(Watts):125mW Temperature Coefficient:±50ppm/℃ Temperature Coefficient:±50ppm/℃ Operating Temperature Range:-55℃~+125℃ Operating Temperature Range:-55℃~+125; LCSC Part Name: 10kΩ ±1% 125mW 金属膜电阻; Supplier Part: C433502; Manufacturer: Tyohm(幸亚电阻); Supplier Footprint: 插件,D1.7xL3.5mm; JLCPCB Part Class: Extended Part; Datasheet: https://atta.szlcsc.com/upload/public/pdf/source/20191008/C433681_B72693A7FD256E0D1DC5EFE3F095EED3.pdf; Supplier: LCSC; Type: Metal Film Resistors; Tolerance: ±1%; Overload Voltage (Max): 150V; Power(Watts): 125mW; Temperature Coefficient: ±50ppm/℃; Operating Temperature Range: -55℃~+125℃
SW49 = TK-6580A-1: Circuit:DPDT Self Lock / No Lock:LATCHING Actuator Style:Projected Plunger Mounting Style:Lying Actuator/Cap Color:White Pin Style:PCPin Operating Force:250gf Mechanical Life:-; LCSC Part Name: 自锁开关5.8*5.8*9.9有声有锁插件六脚DIP按键开关带锁6P脚; Supplier Part: C528770; Manufacturer: Yuandi(元迪); Supplier Footprint: 插件; JLCPCB Part Class: Extended Part; Datasheet: https://atta.szlcsc.com/upload/public/pdf/source/20200831/C528770_3D9C55C6A36B9A979586F85D435EB40C.pdf; Supplier: LCSC; Circuit: DPDT; Self Lock / No Lock: LATCHING; Actuator Style: Projected Plunger; Mounting Style: Lying; Actuator/Cap Color: White; Pin Style: PCPin; Operating Force: 250gf
U6 = 1812L200/33GR: Operating Voltage (Max):33V Current Rating (Max):40A Hold Current:2A Trip Current:4A Power Dissipation:1.4W Resistance - Initial (Ri) (Min):20mΩ Resistance - Post Trip (R1) (Max):100mΩ Maximum Time to Trip:2s Operating Temperature:-40℃~+85℃ Operating Temp; LCSC Part Name: 33V 2A 自恢复保险丝; Supplier Part: C18198343; Manufacturer: LUTE(陆特); Supplier Footprint: 1812; JLCPCB Part Class: Extended Part; Datasheet: https://atta.szlcsc.com/upload/public/pdf/source/20230926/57461D6230B1C3E982BE957E074F147E.pdf; Supplier: LCSC; Operating Voltage (Max): 33V; Current Rating (Max): 40A; Hold Current: 2A; Trip Current: 4A; Power Dissipation: 1.4W; Resistance - Initial (Ri) (Min): 20mΩ; Resistance - Post Trip (R1) (Max): 100mΩ; Maximum Time to Trip: 2s; Operating Temperature: -40℃~+85℃
U8 = SN74AHCT125N: output type:Tri-State Voltage - Supply:4.5V~5.5V Voltage - Supply:4.5V~5.5V Number of Elements:4 Number of Bits per Element:1 Current - Output Low(IOL):8mA Current - Output High(IOH):8mA Logic Family:74AHCT Operating Temperature:-40℃~+85℃ Operating Temper; Supplier Part: C354152; Manufacturer: TI(德州仪器); Supplier Footprint: DIP-14; JLCPCB Part Class: Extended Part; Datasheet: https://www.ti.com/cn/lit/gpn/sn74ahct125; Supplier: LCSC; output type: Tri-State; Voltage - Supply: 4.5V~5.5V; Number of Elements: 4; Number of Bits per Element: 1; Current - Output Low(IOL): 8mA; Current - Output High(IOH): 8mA; Logic Family: 74AHCT; Operating Temperature: -40℃~+85℃

## Nets
3VDC: C50.2 C62.2 C63.2 C73.1 C74.1 C126.2 C133.2 COL_MUX2.24(VCC) D49.1(K) D114.1(K) D116.1(K) R61.1 R63.2 R65.1 R72.1 R73.1 R74.1 R75.1 R76.1 R77.1 R88.1 R92.1 R120.1 R123.1 R132.2 R138.1 R141.1 R150.2 ROW_MUX2.24(VCC) RV4.1 RV5.1 RV6.1 Screen2.2(Pin) SW50.2 SW51.2 SW52.2 SW53.2 SW54.2 SW55.2 U23.2(INA-) U23.8(VDD) U34.2(INA-) U34.8(VDD) U39.2(INA-) U39.8(VDD)
5VDC: C8.1 C9.1 C64.2 R85.2 R93.2 SW49.5 U8.14(VCC) U25.7(VO1)
GND: C5.1 C6.1 C7.1 C8.2 C9.2 C48.1 C49.2 C50.1 C51.1 C52.1 C61.2 C62.1 C63.1 C64.1 C65.2 C66.2 C67.2 C68.2 C69.2 C70.2 C73.2 C74.2 C75.2 C76.2 C77.1 C78.2 C79.2 C80.2 C81.2 C82.2 C83.2 C84.2 C85.2 C86.2 C87.2 C88.2 C89.2 C90.2 C91.2 C92.2 C93.2 C94.2 C95.2 C96.2 C97.2 C98.2 C99.2 C100.2 C101.2 C102.2 C103.2 C104.2 C105.2 C106.2 C107.2 C108.2 C109.2 C110.2 C111.2 C112.2 C113.2 C114.2 C115.2 C116.2 C117.2 C118.2 C119.2 C120.2 C121.2 C124.1 C125.2 C126.1 C127.1 C128.1 C131.1 C132.2 C133.1 C134.1 C135.1 COL_MUX2.3(I6) COL_MUX2.12(GND) COL_MUX2.15(~{E}) D44.2(A) D78.2(DOUT) D79.4(DIN) D109.3(VSS) D110.2(DOUT) D111.2(DOUT) D111.3(VSS) D113.4(DIN) J1.2 J1.3 J8.1 J8.4 J9.1 J9.4 J12.2 J13.2 J14.1 J14.3 J15.1 J15.3 J16.1 J16.4 J17.1 J17.4 J18.1 J18.4 J19.1 J19.4 R60.2 R64.2 R122.2 R129.2 R140.2 R147.2 ROW_MUX2.12(GND) ROW_MUX2.15(~{E}) ROW_MUX2.16(I15) ROW_MUX2.17(I14) ROW_MUX2.18(I13) ROW_MUX2.19(I12) ROW_MUX2.20(I11) ROW_MUX2.21(I10) ROW_MUX2.22(I9) ROW_MUX2.23(I8) RV4.3 RV4.4(EH) RV4.5(EH) RV5.3 RV5.4(EH) RV5.5(EH) RV6.3 RV6.4(EH) RV6.5(EH) Screen2.1(Pin) SW49.1 SW49.3 U8.1(#1OE) U8.4(#2OE) U8.7(GND) U8.8(3Y) U8.9(3A) U8.10(#3OE) U8.11(4Y) U8.12(4A) U8.13(#4OE) U23.4(VSS) U25.5(GND) U25.8(VCC) U26.2 U27.1 U28.2 U29.2 U30.2 U31.1 U32.2 U33.2 U34.4(VSS) U35.2 U36.1 U37.2 U38.2 U39.4(VSS) ; also on sheet 4
VIN_FUSED: C5.2 C6.2 D44.1(K) F1.2 SW49.4 SW49.6 U6.1
VIN_RAW: F1.1 J1.1
CNTRL_LED: D102.2(DOUT) D104.4(DIN)
CNTRLLP: C75.1 D102.3(VSS)
COL1: COL_MUX2.9(I0) R72.2 SW1.2 SW2.2 SW3.2 SW4.2 SW5.2 SW6.2 SW7.2
COL2: COL_MUX2.8(I1) R73.2 SW8.2 SW9.2 SW10.2 SW11.2 SW12.2 SW13.2 SW14.2
COL3: COL_MUX2.7(I2) R74.2 SW15.2 SW16.2 SW17.2 SW18.2 SW19.2 SW20.2 SW21.2
COL4: COL_MUX2.6(I3) R75.2 SW22.2 SW23.2 SW24.2 SW25.2 SW26.2 SW27.2 SW28.2
COL5: COL_MUX2.5(I4) R76.2 SW29.2 SW30.2 SW31.2 SW32.2 SW33.2 SW34.2 SW35.2
COL6: COL_MUX2.4(I5) R77.2 SW36.2 SW37.2 SW38.2 SW39.2 SW40.2 SW41.2 SW42.2
CTRL1: COL_MUX2.2(I7) SW55.1
CTRL2: COL_MUX2.23(I8) SW54.1
CTRL3: COL_MUX2.22(I9) SW53.1
CTRL4: COL_MUX2.21(I10) SW52.1
CTRL5: COL_MUX2.20(I11) SW51.1
CTRL6: COL_MUX2.19(I12) SW50.1
E1: C49.1 R116.2 ; also on sheet 4
E2: C52.2 R117.2 ; also on sheet 4
E3: C125.1 R133.2 ; also on sheet 4
E4: C128.2 R135.2 ; also on sheet 4
E5: C132.1 R151.2 ; also on sheet 4
E6: C135.2 R153.2 ; also on sheet 4
FP1: COL_MUX2.17(I14) RV4.2
FP2: COL_MUX2.16(I15) RV5.2
LED: U8.2(1A) ; also on sheet 4
LEDCNTRL: D61.4(DIN) R20.2
MAIN: COL_MUX2.18(I13) RV6.2
MIDI_OUT: R86.2 R94.2 U8.6(2Y)
MIDI_RX: R88.2 U25.6(VO2) ; also on sheet 4
MIDI_TX: U8.5(2A) ; also on sheet 4
MRC: R95.2 ; also on sheet 4
MRR: ROW_MUX2.1(COM) ; also on sheet 4
MUXC1: COL_MUX2.10(S0) ; also on sheet 4
MUXC2: COL_MUX2.11(S1) ; also on sheet 4
MUXC3: COL_MUX2.14(S2) ; also on sheet 4
MUXC4: COL_MUX2.13(S3) ; also on sheet 4
MUXR1: ROW_MUX2.10(S0) ; also on sheet 4
MUXR2: ROW_MUX2.11(S1) ; also on sheet 4
MUXR3: ROW_MUX2.14(S2) ; also on sheet 4
MUXR4: ROW_MUX2.13(S3) ; also on sheet 4
ROW1: ROW_MUX2.9(I0) SW1.1 SW8.1 SW15.1 SW22.1 SW29.1 SW36.1
ROW2: ROW_MUX2.8(I1) SW2.1 SW9.1 SW16.1 SW23.1 SW30.1 SW37.1
ROW3: ROW_MUX2.7(I2) SW3.1 SW10.1 SW17.1 SW24.1 SW31.1 SW38.1
ROW4: ROW_MUX2.6(I3) SW4.1 SW11.1 SW18.1 SW25.1 SW32.1 SW39.1
ROW5: ROW_MUX2.4(I5) ROW_MUX2.5(I4) SW5.1 SW12.1 SW19.1 SW26.1 SW33.1 SW40.1
ROW6: ROW_MUX2.3(I6) SW6.1 SW13.1 SW20.1 SW27.1 SW34.1 SW41.1
ROW7: ROW_MUX2.2(I7) SW7.1 SW14.1 SW21.1 SW28.1 SW35.1 SW42.1
SCL: R91.1 R92.2 Screen2.3(Pin) ; also on sheet 4
SDA: R91.2 Screen2.4(Pin) ; also on sheet 4
TPWR: SW49.2
VLED: C7.2 C61.1 C76.1 C121.1 D61.1(VDD) D110.1(VDD) U6.2
VREF: C48.2 C51.2 C124.2 C127.2 C131.2 C134.2 R60.1 R61.2 R63.1 R64.1 R65.2 R67.1 R115.2 R118.2 R120.2 R122.1 R123.2 R129.1 R131.2 R132.1 R134.1 R136.2 R138.2 R140.1 R141.2 R147.1 R149.2 R150.1 R152.1 R154.2
$3N903: R20.1 U8.3(1Y)
$3N20199: D95.2(DOUT) D96.4(DIN)
$3N20200: D75.2(DOUT) D76.4(DIN)
$3N20201: C99.1 D86.3(VSS) D87.1(VDD)
$3N20202: C102.1 D89.3(VSS) D90.1(VDD)
$3N20203: C81.1 D64.3(VSS) D65.1(VDD)
$3N20204: C97.1 D83.3(VSS) D84.1(VDD)
$3N20205: C80.1 D63.3(VSS) D64.1(VDD)
$3N20206: D82.2(DOUT) D83.4(DIN)
$3N20207: C70.1 D96.3(VSS) D97.1(VDD)
$3N20208: C87.1 D71.3(VSS) D72.1(VDD)
$3N20209: C103.1 D91.3(VSS) D92.1(VDD)
$3N20210: C67.1 D78.3(VSS) D79.1(VDD)
$3N20211: D94.2(DOUT) D95.4(DIN)
$3N20212: C86.1 D70.3(VSS) D71.1(VDD)
$3N20213: C94.1 D80.3(VSS) D81.1(VDD)
$3N20214: C109.1 D98.3(VSS) D99.1(VDD)
$3N20215: C92.1 D77.3(VSS) D78.1(VDD)
$3N20216: C83.1 D67.3(VSS) D68.1(VDD)
$3N20217: C85.1 D69.3(VSS) D70.1(VDD)
$3N20218: D73.2(DOUT) D74.4(DIN)
$3N20219: C104.1 D92.3(VSS) D93.1(VDD)
$3N20220: C90.1 D75.3(VSS) D76.1(VDD)
$3N20221: C82.1 D65.3(VSS) D66.1(VDD)
$3N20222: D79.2(DOUT) D80.4(DIN)
$3N20223: D80.2(DOUT) D81.4(DIN)
$3N20224: C107.1 D95.3(VSS) D96.1(VDD)
$3N20226: C68.1 D84.3(VSS) D85.1(VDD)
$3N20227: D81.2(DOUT) D82.4(DIN)
$3N20228: D92.2(DOUT) D93.4(DIN)
$3N20229: D72.2(DOUT) D73.4(DIN)
$3N20230: C65.1 D66.3(VSS) D67.1(VDD)
$3N20231: D74.2(DOUT) D75.4(DIN)
$3N20232: D96.2(DOUT) D97.4(DIN)
$3N20233: C84.1 D68.3(VSS) D69.1(VDD)
$3N20234: C111.1 D100.3(VSS) D101.1(VDD)
$3N20235: C88.1 D73.3(VSS) D74.1(VDD)
$3N20236: D67.2(DOUT) D68.4(DIN)
$3N20237: C105.1 D93.3(VSS) D94.1(VDD)
$3N20238: C112.1 D101.3(VSS) D102.1(VDD)
$3N20239: C98.1 D85.3(VSS) D86.1(VDD)
$3N20240: C69.1 D90.3(VSS) D91.1(VDD)
$3N20241: D93.2(DOUT) D94.4(DIN)
$3N20242: C91.1 D76.3(VSS) D77.1(VDD)
$3N20244: C95.1 D81.3(VSS) D82.1(VDD)
$3N20245: C79.1 D62.2(DOUT) D62.3(VSS) D63.1(VDD) D63.4(DIN)
$3N20246: C78.1 D61.3(VSS) D62.1(VDD)
$3N20247: D91.2(DOUT) D92.4(DIN)
$3N20249: C100.1 D87.3(VSS) D88.1(VDD)
$3N20250: C106.1 D94.3(VSS) D95.1(VDD)
$3N20251: D88.2(DOUT) D89.4(DIN)
$3N20252: C93.1 D79.3(VSS) D80.1(VDD)
$3N20253: D77.2(DOUT) D78.4(DIN)
$3N20254: D85.2(DOUT) D86.4(DIN)
$3N20255: C108.1 D97.3(VSS) D98.1(VDD)
$3N20256: C96.1 D82.3(VSS) D83.1(VDD)
$3N20257: C110.1 D99.3(VSS) D100.1(VDD)
$3N20258: D63.2(DOUT) D64.4(DIN)
$3N20259: D86.2(DOUT) D87.4(DIN)
$3N20260: C66.1 D72.3(VSS) D73.1(VDD)
$3N20261: D64.2(DOUT) D65.4(DIN)
$3N20262: D89.2(DOUT) D90.4(DIN)
$3N20263: D99.2(DOUT) D100.4(DIN)
$3N20265: D65.2(DOUT) D66.4(DIN)
$3N20266: D71.2(DOUT) D72.4(DIN)
$3N20267: C89.1 D74.3(VSS) D75.1(VDD)
$3N20268: D83.2(DOUT) D84.4(DIN)
$3N20269: D90.2(DOUT) D91.4(DIN)
$3N20270: D87.2(DOUT) D88.4(DIN)
$3N20271: C101.1 D88.3(VSS) D89.1(VDD)
$3N20272: D68.2(DOUT) D69.4(DIN)
$3N20273: D66.2(DOUT) D67.4(DIN)
$3N20274: D97.2(DOUT) D98.4(DIN)
$3N20275: D101.2(DOUT) D102.4(DIN)
$3N20276: D100.2(DOUT) D101.4(DIN)
$3N20277: D76.2(DOUT) D77.4(DIN)
$3N20278: D61.2(DOUT) D62.4(DIN)
$3N20279: D69.2(DOUT) D70.4(DIN)
$3N20280: D98.2(DOUT) D99.4(DIN)
$3N20281: D70.2(DOUT) D71.4(DIN)
$3N20282: D84.2(DOUT) D85.4(DIN)
$4N5520: J13.5 R86.1
$4N5522: J13.4 R85.1
$4N5523: D103.2(A) R87.1 U25.3(C2)
$4N5524: J12.5 J14.4 R87.2
$4N5601: D104.2(DOUT) D105.4(DIN)
$4N5602: D105.2(DOUT) D106.4(DIN)
$4N5603: D106.2(DOUT) D107.4(DIN)
$4N5604: D107.2(DOUT) D108.4(DIN)
$4N5605: D108.2(DOUT) D109.4(DIN)
$4N5606: D109.2(DOUT) D110.4(DIN)
$4N5609: C113.1 D104.3(VSS) D105.1(VDD)
$4N5610: C114.1 D105.3(VSS) D106.1(VDD)
$4N5611: C115.1 D106.3(VSS) D107.1(VDD)
$4N5612: C116.1 D107.3(VSS) D108.1(VDD)
$4N5613: C117.1 D108.3(VSS) D109.1(VDD)
$4N5618: C118.1 D110.3(VSS) D113.1(VDD)
$4N5619: C119.1 D112.1(VDD) D113.3(VSS)
$4N5620: D112.4(DIN) D113.2(DOUT)
$4N5621: C120.1 D111.1(VDD) D112.3(VSS)
$4N5622: D111.4(DIN) D112.2(DOUT)
$4N5624: D103.1(K) J12.4 J14.2 U25.2(C1)
$4N5626: J15.2 R93.1
$4N5628: J15.4 R94.1
$4N5636: C77.2 COL_MUX2.1(COM) R95.1
$5N1244: D50.1(K) R67.2 U23.6(INB-)
$5N1257: J8.2 R102.2 U27.2
$5N1260: J8.3 R103.2 U26.1
$5N1268: J9.3 R105.2 U28.1
$5N1271: J9.2 R104.2 U29.1
$5N1301: R104.1 R105.1 R119.1
$5N1416: D49.2(A) R62.1
$5N1427: R102.1 R103.1 R114.1
$5N1529: C122.1 R114.2
$5N1584: C122.2 R115.1 U23.3(INA+)
$5N1729: R62.2 R116.1 U23.1(OUTA)
$5N1751: R66.2 R117.1 U23.7(OUTB)
$5N1755: D50.2(A) R66.1
$5N2006: C123.1 R119.2
$5N2011: C123.2 R118.1 U23.5(INB+)
$5N4510: D115.1(K) R134.2 U34.6(INB-)
$5N4519: J16.2 R125.2 U31.2
$5N4520: J16.3 R126.2 U30.1
$5N4521: J17.3 R128.2 U32.1
$5N4522: J17.2 R127.2 U33.1
$5N4527: R127.1 R128.1 R137.1
$5N4528: D114.2(A) R121.1
$5N4531: R125.1 R126.1 R130.1
$5N4532: C129.1 R130.2
$5N4534: C129.2 R131.1 U34.3(INA+)
$5N4535: R121.2 R133.1 U34.1(OUTA)
$5N4539: R124.2 R135.1 U34.7(OUTB)
$5N4540: D115.2(A) R124.1
$5N4542: C130.1 R137.2
$5N4543: C130.2 R136.1 U34.5(INB+)
$5N6041: D117.1(K) R152.2 U39.6(INB-)
$5N6050: J18.2 R143.2 U36.2
$5N6051: J18.3 R144.2 U35.1
$5N6052: J19.3 R146.2 U37.1
$5N6053: J19.2 R145.2 U38.1
$5N6058: R145.1 R146.1 R155.1
$5N6059: D116.2(A) R139.1
$5N6062: R143.1 R144.1 R148.1
$5N6063: C136.1 R148.2
$5N6065: C136.2 R149.1 U39.3(INA+)
$5N6066: R139.2 R151.1 U39.1(OUTA)
$5N6070: R142.2 R153.1 U39.7(OUTB)
$5N6071: D117.2(A) R142.1
$5N6073: C137.1 R155.2
$5N6074: C137.2 R154.1 U39.5(INB+)

Not connected (* = marked no-connect by the designer): D104 1(VDD); J12 1 3* 6* 7*; J13 1* 3* 6* 7*; U25 1(NC)* 4(NC)*

## Notes on the sheets
sheet 1
- POWER
- LED MATRIX
- BUTTON MATRIX
sheet 2
- INTERFACE & CONTROL
- CNTRL MATRIX
- MIDI
- MOADkNOBS-42 BUTTON
- 1
- MOARkNOBS v2
- 12/03/25
- 5b
